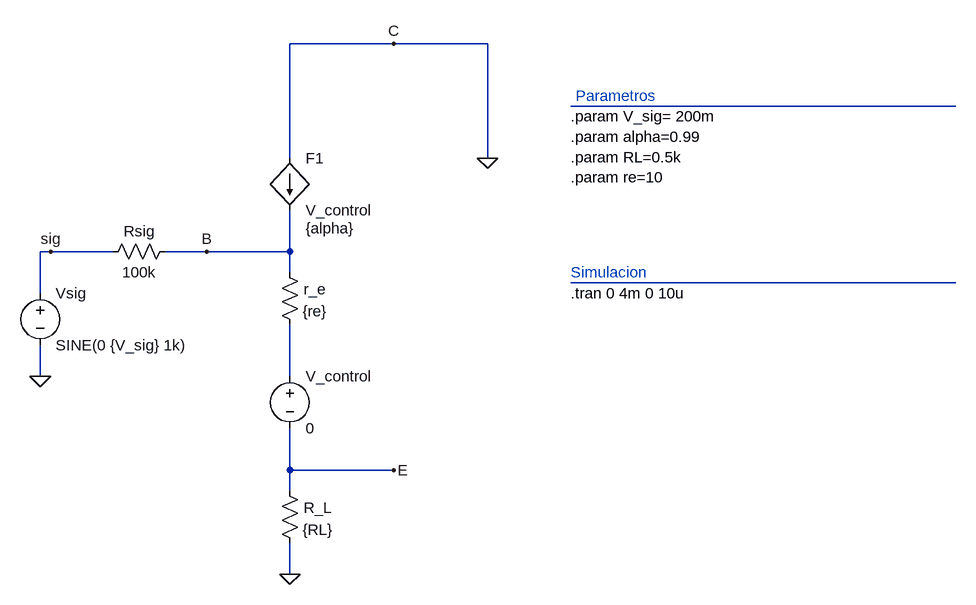
[diagram p0: schematic CC_ejemplo1_parte3.asc]
CC_ejemplo1_parte3.asc, the LTspice schematic file:
Version 4
SHEET 1 1220 680
WIRE -16 -208 -176 -208
WIRE 128 -208 -16 -208
WIRE 848 -112 256 -112
WIRE -176 -32 -176 -208
WIRE 128 -32 128 -208
WIRE -544 112 -560 112
WIRE -448 112 -544 112
WIRE -304 112 -368 112
WIRE -176 112 -176 48
WIRE -176 112 -304 112
WIRE -176 144 -176 112
WIRE 848 160 256 160
WIRE -560 176 -560 112
WIRE -560 304 -560 256
WIRE -176 304 -176 224
WIRE -176 448 -176 384
WIRE -16 448 -176 448
WIRE -176 480 -176 448
WIRE -176 608 -176 560
FLAG -560 304 0
FLAG 128 -32 0
FLAG -544 112 sig
FLAG -16 -208 C
FLAG -176 608 0
FLAG -16 448 E
FLAG -304 112 B
SYMBOL voltage -560 160 R0
WINDOW 123 0 0 Left 0
WINDOW 39 0 0 Left 0
SYMATTR InstName Vsig
SYMATTR Value SINE(0 {V_sig} 1k)
SYMBOL res -192 128 R0
WINDOW 0 37 42 Left 2
SYMATTR InstName r_e
SYMATTR Value {re}
SYMBOL res -464 128 R270
WINDOW 0 32 56 VTop 2
WINDOW 3 0 56 VBottom 2
SYMATTR InstName Rsig
SYMATTR Value 100k
SYMBOL res -192 464 R0
WINDOW 0 37 42 Left 2
SYMATTR InstName R_L
SYMATTR Value {RL}
SYMBOL f -176 -32 R0
WINDOW 123 24 108 Left 2
SYMATTR Value2 {alpha}
SYMATTR InstName F1
SYMATTR Value V_control
SYMBOL voltage -176 288 R0
SYMATTR InstName V_control
SYMATTR Value 0
TEXT 256 -96 Left 2 !.param V_sig= 200m\n.param alpha=0.99\n.param RL=0.5k\n.param re=10
TEXT 256 176 Left 2 !.tran 0 4m 0 10u
TEXT 264 -128 Left 2 ;Parametros
TEXT 256 144 Left 2 ;Simulacion

The netlist it stands for:
* CC_ejemplo1_parte3.asc
Vsig sig 0 SINE(0 {V_sig} 1k)
r_e B N003 {re}
Rsig sig B 100k
R_L E 0 {RL}
F1 0 B V_control {alpha}
V_control N003 E 0
.param V_sig= 200m
.param alpha=0.99
.param RL=0.5k
.param re=10
.tran 0 4m 0 10u
* Parametros
* Simulacion
.backanno
.end